# EAGLE design Resistor Module (EAGLE 6.4)

## Sheet 1 of 4: Resistor Bank
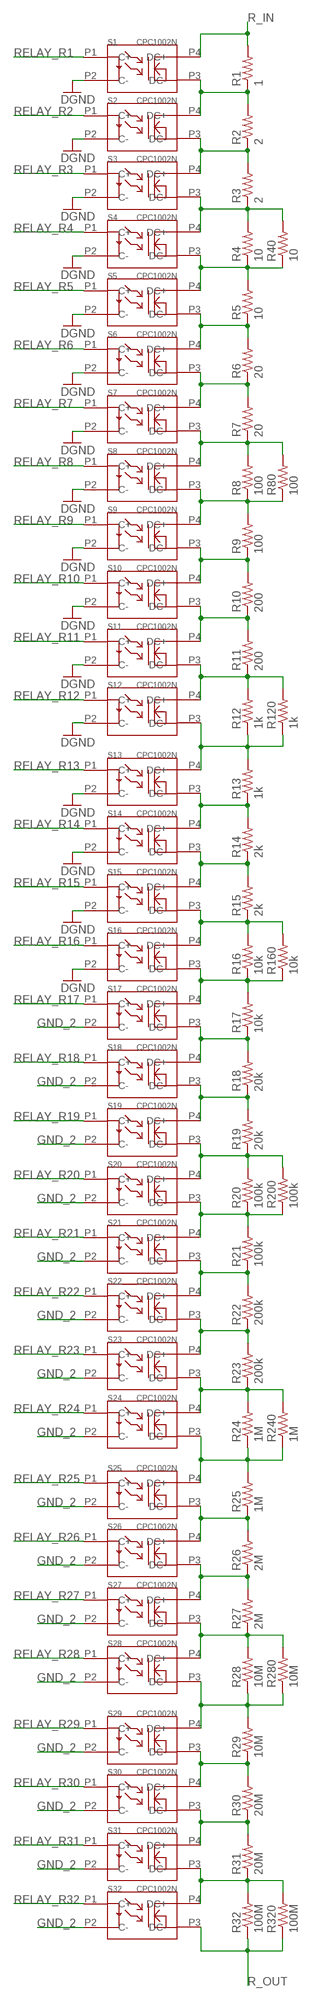
[diagram p0: schematic, sheet 1]

### Parts
R1  1  RESISTOR1206  [1206]
R2  2  RESISTOR1206  [1206]
R3  2  RESISTOR1206  [1206]
R4  10  RESISTOR1206  [1206]
R5  10  RESISTOR1206  [1206]
R6  20  RESISTOR1206  [1206]
R7  20  RESISTOR1206  [1206]
R8  100  RESISTOR1206  [1206]
R9  100  RESISTOR1206  [1206]
R10  200  RESISTOR1206  [1206]
R11  200  RESISTOR1206  [1206]
R12  1k  RESISTOR1206  [1206]
R13  1k  RESISTOR1206  [1206]
R14  2k  RESISTOR1206  [1206]
R15  2k  RESISTOR1206  [1206]
R16  10k  RESISTOR1206  [1206]
R17  10k  RESISTOR1206  [1206]
R18  20k  RESISTOR1206  [1206]
R19  20k  RESISTOR1206  [1206]
R20  100k  RESISTOR1206  [1206]
R21  100k  RESISTOR1206  [1206]
R22  200k  RESISTOR1206  [1206]
R23  200k  RESISTOR1206  [1206]
R24  1M  RESISTOR1206  [1206]
R25  1M  RESISTOR1206  [1206]
R26  2M  RESISTOR1206  [1206]
R27  2M  RESISTOR1206  [1206]
R28  10M  RESISTOR1206  [1206]
R29  10M  RESISTOR1206  [1206]
R30  20M  RESISTOR1206  [1206]
R31  20M  RESISTOR1206  [1206]
R32  100M  RESISTOR1206  [1206]
R40  10  RESISTOR1206  [1206]
R80  100  RESISTOR1206  [1206]
R120  1k  RESISTOR1206  [1206]
R160  10k  RESISTOR1206  [1206]
R200  100k  RESISTOR1206  [1206]
R240  1M  RESISTOR1206  [1206]
R280  10M  RESISTOR1206  [1206]
R320  100M  RESISTOR1206  [1206]
S1  CPC1002N  [CPC1002N]
S2  CPC1002N  [CPC1002N]
S3  CPC1002N  [CPC1002N]
S4  CPC1002N  [CPC1002N]
S5  CPC1002N  [CPC1002N]
S6  CPC1002N  [CPC1002N]
S7  CPC1002N  [CPC1002N]
S8  CPC1002N  [CPC1002N]
S9  CPC1002N  [CPC1002N]
S10  CPC1002N  [CPC1002N]
S11  CPC1002N  [CPC1002N]
S12  CPC1002N  [CPC1002N]
S13  CPC1002N  [CPC1002N]
S14  CPC1002N  [CPC1002N]
S15  CPC1002N  [CPC1002N]
S16  CPC1002N  [CPC1002N]
S17  CPC1002N  [CPC1002N]
S18  CPC1002N  [CPC1002N]
S19  CPC1002N  [CPC1002N]
S20  CPC1002N  [CPC1002N]
S21  CPC1002N  [CPC1002N]
S22  CPC1002N  [CPC1002N]
S23  CPC1002N  [CPC1002N]
S24  CPC1002N  [CPC1002N]
S25  CPC1002N  [CPC1002N]
S26  CPC1002N  [CPC1002N]
S27  CPC1002N  [CPC1002N]
S28  CPC1002N  [CPC1002N]
S29  CPC1002N  [CPC1002N]
S30  CPC1002N  [CPC1002N]
S31  CPC1002N  [CPC1002N]
S32  CPC1002N  [CPC1002N]

### Nets
GND: S1.P2(C-) S2.P2(C-) S3.P2(C-) S4.P2(C-) S5.P2(C-) S6.P2(C-) S7.P2(C-) S8.P2(C-) S9.P2(C-) S10.P2(C-) S11.P2(C-) S12.P2(C-) S13.P2(C-) S14.P2(C-) S15.P2(C-) S16.P2(C-) ; supply symbol labelled DGND ; also sheet 2,3
GND_2: S17.P2(C-) S18.P2(C-) S19.P2(C-) S20.P2(C-) S21.P2(C-) S22.P2(C-) S23.P2(C-) S24.P2(C-) S25.P2(C-) S26.P2(C-) S27.P2(C-) S28.P2(C-) S29.P2(C-) S30.P2(C-) S31.P2(C-) S32.P2(C-) ; also sheet 2,3
N$3: R2.1 R3.2 S2.P3(DC-) S3.P4(DC+)
N$4: R3.1 R4.2 R40.2 S3.P3(DC-) S4.P4(DC+)
N$5: R4.1 R5.2 R40.1 S4.P3(DC-) S5.P4(DC+)
N$6: R5.1 R6.2 S5.P3(DC-) S6.P4(DC+)
N$7: R6.1 R7.2 S6.P3(DC-) S7.P4(DC+)
N$8: R7.1 R8.2 R80.2 S7.P3(DC-) S8.P4(DC+)
N$10: R9.1 R10.2 S9.P3(DC-) S10.P4(DC+)
N$11: R10.1 R11.2 S10.P3(DC-) S11.P4(DC+)
N$15: R11.1 R12.2 R120.2 S11.P3(DC-) S12.P4(DC+)
N$25: R1.1 R2.2 S1.P3(DC-) S2.P4(DC+)
N$41: R14.1 R15.2 S14.P3(DC-) S15.P4(DC+)
N$42: R15.1 R16.2 R160.2 S15.P3(DC-) S16.P4(DC+)
N$44: R17.1 R18.2 S17.P3(DC-) S18.P4(DC+)
N$45: R18.1 R19.2 S18.P3(DC-) S19.P4(DC+)
N$46: R19.1 R20.2 R200.2 S19.P3(DC-) S20.P4(DC+)
N$47: R20.1 R21.2 R200.1 S20.P3(DC-) S21.P4(DC+)
N$48: R21.1 R22.2 S21.P3(DC-) S22.P4(DC+)
N$49: R22.1 R23.2 S22.P3(DC-) S23.P4(DC+)
N$50: R23.1 R24.2 R240.2 S23.P3(DC-) S24.P4(DC+)
N$51: R13.1 R14.2 S13.P3(DC-) S14.P4(DC+)
N$52: R24.1 R25.2 R240.1 S24.P3(DC-) S25.P4(DC+)
N$53: R28.1 R29.2 R280.1 S28.P3(DC-) S29.P4(DC+)
N$54: R25.1 R26.2 S25.P3(DC-) S26.P4(DC+)
N$55: R26.1 R27.2 S26.P3(DC-) S27.P4(DC+)
N$56: R27.1 R28.2 R280.2 S27.P3(DC-) S28.P4(DC+)
N$58: R29.1 R30.2 S29.P3(DC-) S30.P4(DC+)
N$59: R30.1 R31.2 S30.P3(DC-) S31.P4(DC+)
N$60: R31.1 R32.2 R320.2 S31.P3(DC-) S32.P4(DC+)
R80: R8.1 R9.2 R80.1 S8.P3(DC-) S9.P4(DC+)
R120: R12.1 R13.2 R120.1 S12.P3(DC-) S13.P4(DC+)
R160: R16.1 R17.2 R160.1 S16.P3(DC-) S17.P4(DC+)
R_IN: R1.2 S1.P4(DC+) ; also sheet 3
R_OUT: R32.1 R320.1 S32.P3(DC-) ; also sheet 3
RELAY_R1: S1.P1(C+) ; also sheet 2
RELAY_R2: S2.P1(C+) ; also sheet 2
RELAY_R3: S3.P1(C+) ; also sheet 2
RELAY_R4: S4.P1(C+) ; also sheet 2
RELAY_R5: S5.P1(C+) ; also sheet 2
RELAY_R6: S6.P1(C+) ; also sheet 2
RELAY_R7: S7.P1(C+) ; also sheet 2
RELAY_R8: S8.P1(C+) ; also sheet 2
RELAY_R9: S9.P1(C+) ; also sheet 2
RELAY_R10: S10.P1(C+) ; also sheet 2
RELAY_R11: S11.P1(C+) ; also sheet 2
RELAY_R12: S12.P1(C+) ; also sheet 2
RELAY_R13: S13.P1(C+) ; also sheet 2
RELAY_R14: S14.P1(C+) ; also sheet 2
RELAY_R15: S15.P1(C+) ; also sheet 2
RELAY_R16: S16.P1(C+) ; also sheet 2
RELAY_R17: S17.P1(C+) ; also sheet 2
RELAY_R18: S18.P1(C+) ; also sheet 2
RELAY_R19: S19.P1(C+) ; also sheet 2
RELAY_R20: S20.P1(C+) ; also sheet 2
RELAY_R21: S21.P1(C+) ; also sheet 2
RELAY_R22: S22.P1(C+) ; also sheet 2
RELAY_R23: S23.P1(C+) ; also sheet 2
RELAY_R24: S24.P1(C+) ; also sheet 2
RELAY_R25: S25.P1(C+) ; also sheet 2
RELAY_R26: S26.P1(C+) ; also sheet 2
RELAY_R27: S27.P1(C+) ; also sheet 2
RELAY_R28: S28.P1(C+) ; also sheet 2
RELAY_R29: S29.P1(C+) ; also sheet 2
RELAY_R30: S30.P1(C+) ; also sheet 2
RELAY_R31: S31.P1(C+) ; also sheet 2
RELAY_R32: S32.P1(C+) ; also sheet 2

## Sheet 2 of 4: Logic
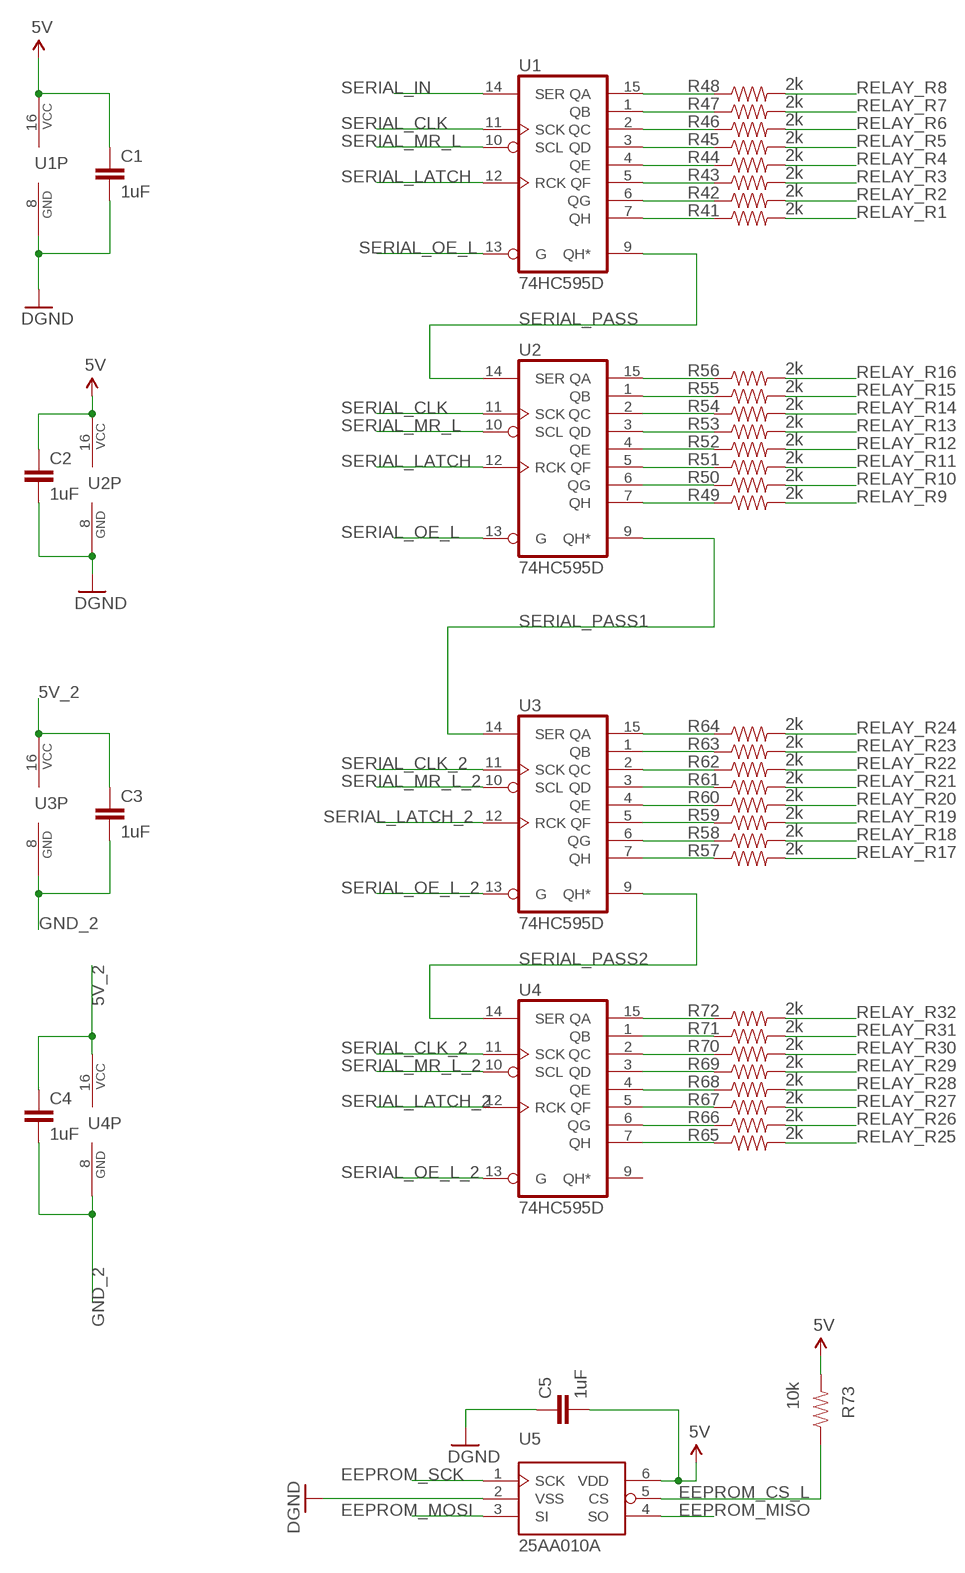
[diagram p1: schematic, sheet 2]

### Parts
C1  1uF  CAP0603-CAP  [0603-CAP]
C2  1uF  CAP0603-CAP  [0603-CAP]
C3  1uF  CAP0603-CAP  [0603-CAP]
C4  1uF  CAP0603-CAP  [0603-CAP]
C5  1uF  CAP0603-CAP  [0603-CAP]
R41  2k  RESISTOR0603-RES  [0603-RES]
R42  2k  RESISTOR0603-RES  [0603-RES]
R43  2k  RESISTOR0603-RES  [0603-RES]
R44  2k  RESISTOR0603-RES  [0603-RES]
R45  2k  RESISTOR0603-RES  [0603-RES]
R46  2k  RESISTOR0603-RES  [0603-RES]
R47  2k  RESISTOR0603-RES  [0603-RES]
R48  2k  RESISTOR0603-RES  [0603-RES]
R49  2k  RESISTOR0603-RES  [0603-RES]
R50  2k  RESISTOR0603-RES  [0603-RES]
R51  2k  RESISTOR0603-RES  [0603-RES]
R52  2k  RESISTOR0603-RES  [0603-RES]
R53  2k  RESISTOR0603-RES  [0603-RES]
R54  2k  RESISTOR0603-RES  [0603-RES]
R55  2k  RESISTOR0603-RES  [0603-RES]
R56  2k  RESISTOR0603-RES  [0603-RES]
R57  2k  RESISTOR0603-RES  [0603-RES]
R58  2k  RESISTOR0603-RES  [0603-RES]
R59  2k  RESISTOR0603-RES  [0603-RES]
R60  2k  RESISTOR0603-RES  [0603-RES]
R61  2k  RESISTOR0603-RES  [0603-RES]
R62  2k  RESISTOR0603-RES  [0603-RES]
R63  2k  RESISTOR0603-RES  [0603-RES]
R64  2k  RESISTOR0603-RES  [0603-RES]
R65  2k  RESISTOR0603-RES  [0603-RES]
R66  2k  RESISTOR0603-RES  [0603-RES]
R67  2k  RESISTOR0603-RES  [0603-RES]
R68  2k  RESISTOR0603-RES  [0603-RES]
R69  2k  RESISTOR0603-RES  [0603-RES]
R70  2k  RESISTOR0603-RES  [0603-RES]
R71  2k  RESISTOR0603-RES  [0603-RES]
R72  2k  RESISTOR0603-RES  [0603-RES]
R73  10k  RESISTOR0603-RES  [0603-RES]
U1  74HC595D  [SO16]
U2  74HC595D  [SO16]
U3  74HC595D  [SO16]
U4  74HC595D  [SO16]
U5  25AA010A  [SOT23-6]

### Nets
5V: C1.1 C2.1 C5.2 R73.2 U1.16(VCC) U2.16(VCC) U5.6(VDD) ; also sheet 3
5V_2: C3.1 C4.1 U3.16(VCC) U4.16(VCC) ; also sheet 3
EEPROM_CS_L: R73.1 U5.5(CS) ; also sheet 3
EEPROM_MISO: U5.4(SO) ; also sheet 3
EEPROM_MOSI: U5.3(SI) ; also sheet 3
EEPROM_SCK: U5.1(SCK) ; also sheet 3
GND: C1.2 C2.2 C5.1 U1.8(GND) U2.8(GND) U5.2(VSS) ; supply symbol labelled DGND ; also sheet 1,3
GND_2: C3.2 C4.2 U3.8(GND) U4.8(GND) ; also sheet 1,3
N$1: R48.1 U1.15(QA)
N$2: R47.1 U1.1(QB)
N$9: R46.1 U1.2(QC)
N$12: R45.1 U1.3(QD)
N$13: R44.1 U1.4(QE)
N$14: R43.1 U1.5(QF)
N$16: R42.1 U1.6(QG)
N$17: R41.1 U1.7(QH)
N$18: R56.1 U2.15(QA)
N$19: R55.1 U2.1(QB)
N$20: R54.1 U2.2(QC)
N$21: R53.1 U2.3(QD)
N$22: R52.1 U2.4(QE)
N$23: R51.1 U2.5(QF)
N$24: R50.1 U2.6(QG)
N$26: R49.1 U2.7(QH)
N$27: R64.1 U3.15(QA)
N$28: R63.1 U3.1(QB)
N$29: R62.1 U3.2(QC)
N$30: R61.1 U3.3(QD)
N$31: R60.1 U3.4(QE)
N$32: R59.1 U3.5(QF)
N$33: R58.1 U3.6(QG)
N$34: R57.1 U3.7(QH)
N$35: R72.1 U4.15(QA)
N$36: R71.1 U4.1(QB)
N$37: R70.1 U4.2(QC)
N$38: R69.1 U4.3(QD)
N$39: R68.1 U4.4(QE)
N$40: R67.1 U4.5(QF)
N$43: R66.1 U4.6(QG)
N$57: R65.1 U4.7(QH)
RELAY_R1: R41.2 ; also sheet 1
RELAY_R2: R42.2 ; also sheet 1
RELAY_R3: R43.2 ; also sheet 1
RELAY_R4: R44.2 ; also sheet 1
RELAY_R5: R45.2 ; also sheet 1
RELAY_R6: R46.2 ; also sheet 1
RELAY_R7: R47.2 ; also sheet 1
RELAY_R8: R48.2 ; also sheet 1
RELAY_R9: R49.2 ; also sheet 1
RELAY_R10: R50.2 ; also sheet 1
RELAY_R11: R51.2 ; also sheet 1
RELAY_R12: R52.2 ; also sheet 1
RELAY_R13: R53.2 ; also sheet 1
RELAY_R14: R54.2 ; also sheet 1
RELAY_R15: R55.2 ; also sheet 1
RELAY_R16: R56.2 ; also sheet 1
RELAY_R17: R57.2 ; also sheet 1
RELAY_R18: R58.2 ; also sheet 1
RELAY_R19: R59.2 ; also sheet 1
RELAY_R20: R60.2 ; also sheet 1
RELAY_R21: R61.2 ; also sheet 1
RELAY_R22: R62.2 ; also sheet 1
RELAY_R23: R63.2 ; also sheet 1
RELAY_R24: R64.2 ; also sheet 1
RELAY_R25: R65.2 ; also sheet 1
RELAY_R26: R66.2 ; also sheet 1
RELAY_R27: R67.2 ; also sheet 1
RELAY_R28: R68.2 ; also sheet 1
RELAY_R29: R69.2 ; also sheet 1
RELAY_R30: R70.2 ; also sheet 1
RELAY_R31: R71.2 ; also sheet 1
RELAY_R32: R72.2 ; also sheet 1
SERIAL_CLK: U1.11(SCK) U2.11(SCK) ; also sheet 3
SERIAL_CLK_2: U3.11(SCK) U4.11(SCK) ; also sheet 3
SERIAL_IN: U1.14(SER) ; also sheet 3
SERIAL_LATCH: U1.12(RCK) U2.12(RCK) ; also sheet 3
SERIAL_LATCH_2: U3.12(RCK) U4.12(RCK) ; also sheet 3
SERIAL_MR_L: U1.10(SCL) U2.10(SCL) ; also sheet 3
SERIAL_MR_L_2: U3.10(SCL) U4.10(SCL) ; also sheet 3
SERIAL_OE_L: U1.13(G) U2.13(G) ; also sheet 3
SERIAL_OE_L_2: U3.13(G) U4.13(G) ; also sheet 3
SERIAL_PASS: U1.9(QH*) U2.14(SER)
SERIAL_PASS1: U2.9(QH*) U3.14(SER)
SERIAL_PASS2: U3.9(QH*) U4.14(SER)
Unconnected: U4.9(QH*)

## Sheet 3 of 4: Interface
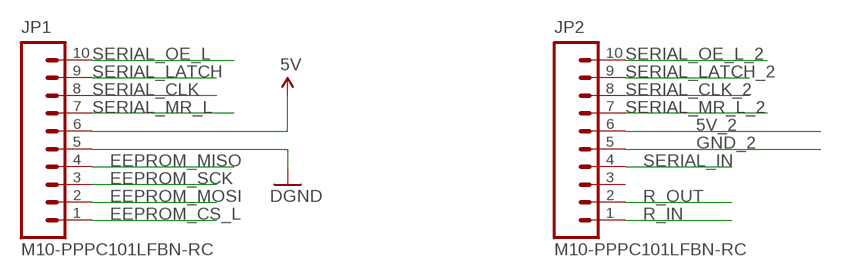
[diagram p2: schematic, sheet 3]

### Parts
JP1  M10-PPPC101LFBN-RC  [PPPC101LFBN-RC]
JP2  M10-PPPC101LFBN-RC  [PPPC101LFBN-RC]

### Nets
5V: JP1.6 ; also sheet 2
5V_2: JP2.6 ; also sheet 2
EEPROM_CS_L: JP1.1 ; also sheet 2
EEPROM_MISO: JP1.4 ; also sheet 2
EEPROM_MOSI: JP1.2 ; also sheet 2
EEPROM_SCK: JP1.3 ; also sheet 2
GND: JP1.5 ; supply symbol labelled DGND ; also sheet 1,2
GND_2: JP2.5 ; also sheet 1,2
R_IN: JP2.1 ; also sheet 1
R_OUT: JP2.2 ; also sheet 1
SERIAL_CLK: JP1.8 ; also sheet 2
SERIAL_CLK_2: JP2.8 ; also sheet 2
SERIAL_IN: JP2.4 ; also sheet 2
SERIAL_LATCH: JP1.9 ; also sheet 2
SERIAL_LATCH_2: JP2.9 ; also sheet 2
SERIAL_MR_L: JP1.7 ; also sheet 2
SERIAL_MR_L_2: JP2.7 ; also sheet 2
SERIAL_OE_L: JP1.10 ; also sheet 2
SERIAL_OE_L_2: JP2.10 ; also sheet 2
Unconnected: JP2.3

## Sheet 4 of 4: Mechanical
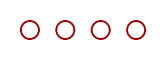
[diagram p3: schematic, sheet 4]

### Parts
STANDOFF1  STAND-OFF  [STAND-OFF]
STANDOFF2  STAND-OFF  [STAND-OFF]
STANDOFF3  STAND-OFF  [STAND-OFF]
STANDOFF4  STAND-OFF  [STAND-OFF]

## Library data of the parts
C1-C5 = Resistor Module Library:CAP: Capacitor Standard 0603 ceramic capacitor, and 0.1" leaded capacitor.
JP1 JP2 = Resistor Module Library:M10: Header 10 Standard 10-pin 0.1" header. Use with straight break away headers (SKU : PRT-00116), right angle break away headers (PRT-00553), swiss pins (PRT-00743), machine pins (PRT-00117), and female headers (PRT-00115).
R1-R32 R40-R73 R80 R120 R160 R200 R240 R280 R320 = Resistor Module Library:RESISTOR: Resistor Basic schematic elements and footprints for 0603, 1206, and PTH resistors.
S1-S32 = Resistor Module Library:CPC1002N
STANDOFF1-STANDOFF4 = Resistor Module Library:STAND-OFF: #4 Stand Off This is the mechanical footprint for a #4 phillips button head screw. Use the keepout ring to avoid running the screw head into surrounding components. SKU : PRT-00447
U1-U4 = Resistor Module Library:74*595: 8-bit SHIFT REGISTER, output latch
U5 = Resistor Module Library:25AA010A

## Board
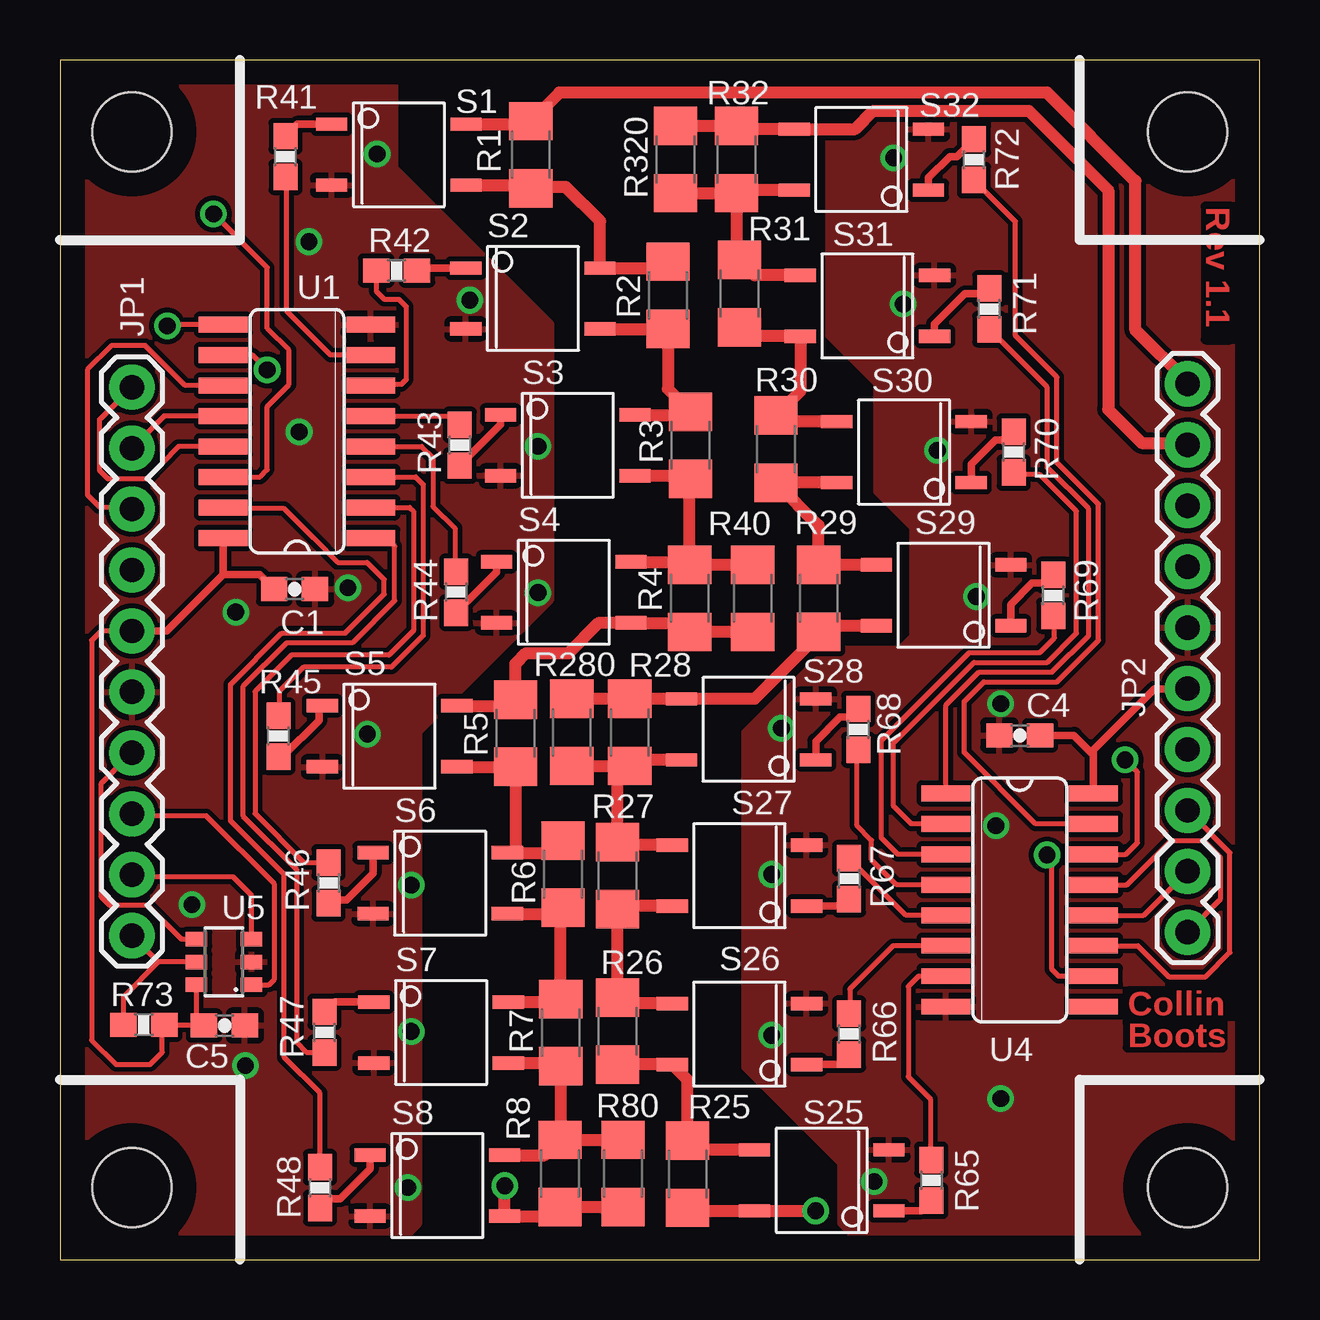
[diagram p4: board, top side]
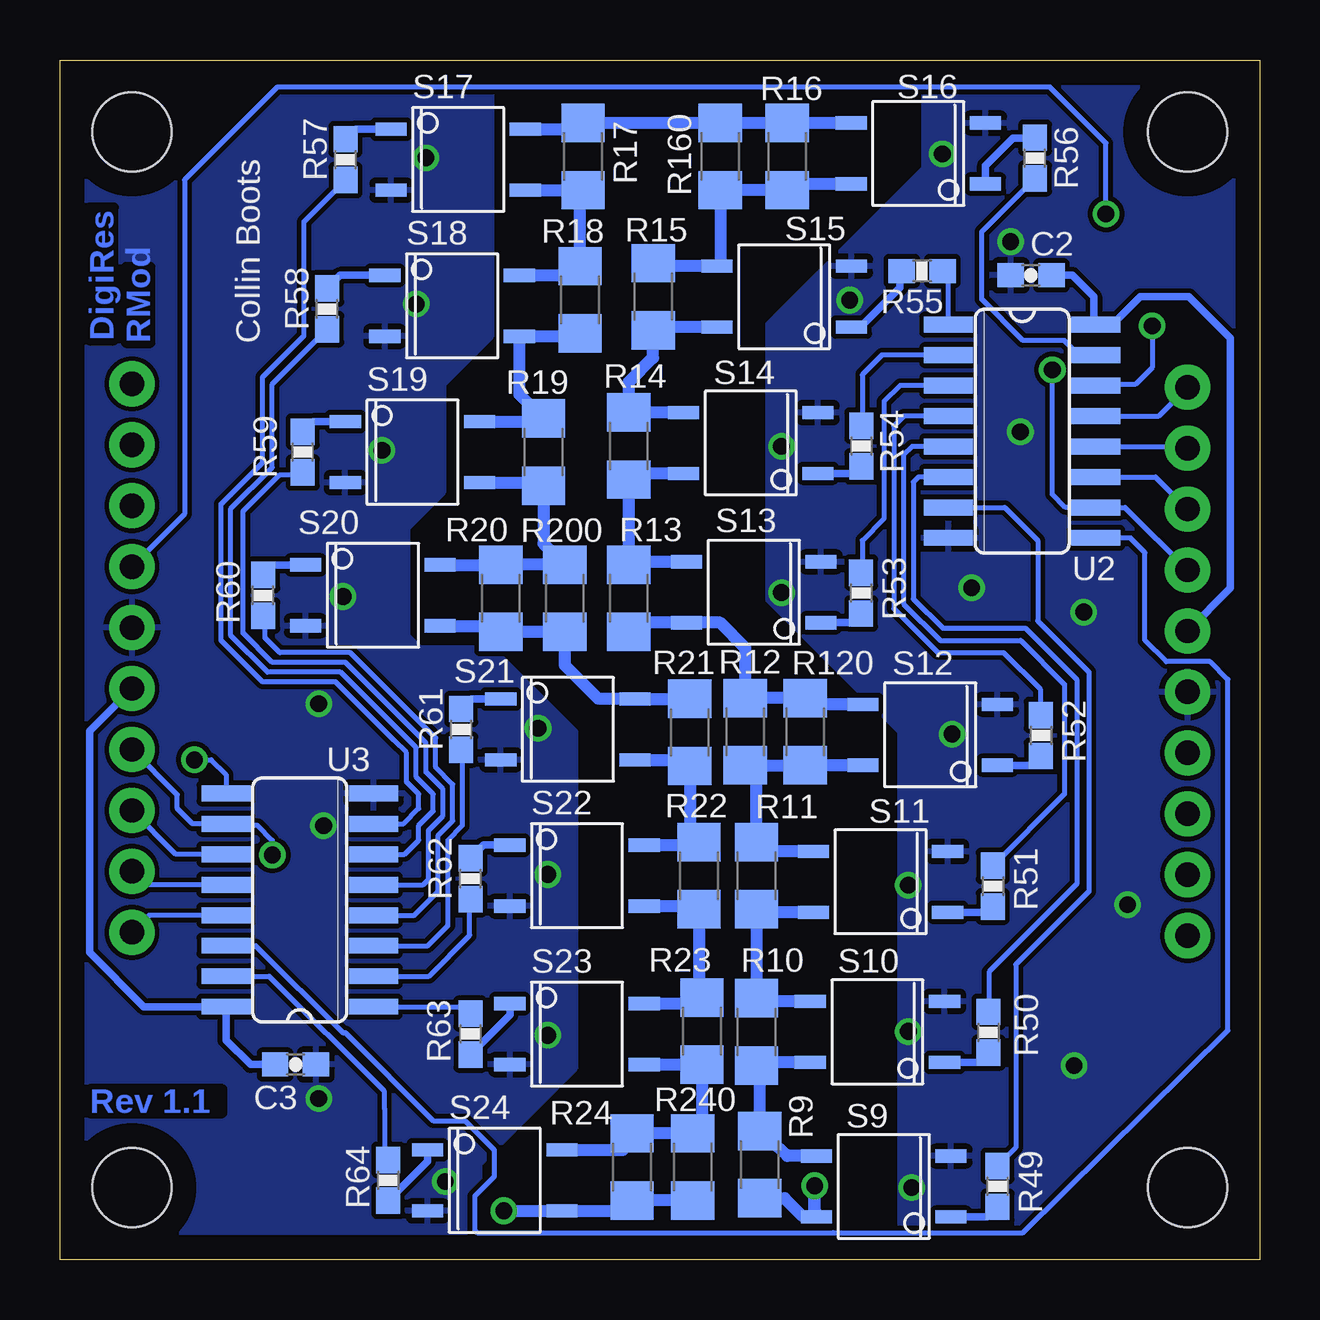
[diagram p5: board, bottom side, seen from below]

Size 50 x 50 mm. Coordinates in mm from the lower left corner, seen from the top.
Outline: 0,0 50,0 50,50 0,50 0,0
Copper layers (1*16): Top 0.035mm / dielectric 1.5mm / Bottom 0.035mm
Design rules "default *": minimum track width 8mil, minimum drill 24mil, track to track 8mil, track to pad 8mil, pad to pad 8mil, via to via 8mil, smd to smd 8mil, copper to edge 40mil, drill to drill 8mil, minimum pad ring 10mil, minimum via ring 8mil, stop-mask expansion 4mil, vias tented up to drill 30mil, thermal gap 10mil

### Footprints (pad centres in the part's own frame; a part is rotated, then mirrored left to right if it is on the bottom)
0603-CAP = smd 1.1 x 1: 1 -0.85,0; 2 0.85,0
PPPC101LFBN-RC = drill 1.016 pad 1.88: 1 0,0; 2 2.54,0; 3 5.08,0; 4 7.62,0; 5 10.16,0; 6 12.7,0; 7 15.24,0; 8 17.78,0; 9 20.32,0; 10 22.86,0
1206 = smd 1.6 x 1.8: 1 -1.4,0; 2 1.4,0
0603-RES = smd 1.1 x 1: 1 -0.85,0; 2 0.85,0
CPC1002N = smd 0.551 x 1.3: P1 -1.27,-2.8; P2 1.27,-2.8; P3 1.27,2.8; P4 -1.27,2.8
STAND-OFF = hole 3.302: 0,0
SO16 = smd 0.66 x 2.032: 1 -4.445,-3.073; 2 -3.175,-3.073; 3 -1.905,-3.073; 4 -0.635,-3.073; 5 0.635,-3.073; 6 1.905,-3.073; 7 3.175,-3.073; 8 4.445,-3.073; 9 4.445,3.073; 10 3.175,3.073; 11 1.905,3.073; 12 0.635,3.073; 13 -0.635,3.073; 14 -1.905,3.073; 15 -3.175,3.073; 16 -4.445,3.073
SOT23-6 = smd 0.6 x 0.9: 1 -0.95,-1.15; 2 0,-1.15; 3 0.95,-1.15; 4 0.95,1.15; 5 0,1.15; 6 -0.95,1.15

### Placement (x,y rotation side)
C1  9.78,27.94 0 top
C2  9.53,41.02 180 bottom
C3  40.18,8.13 0 bottom
C4  40.01,21.84 180 top
C5  6.86,9.75 180 top
JP1  3,13.5 90 top
JP2  47,36.5 270 top
R1  19.63,46.05 90 top
R2  25.34,40.19 90 top
R3  26.29,33.94 90 top
R4  26.25,27.56 90 top
R5  18.98,21.94 90 top
R6  20.97,16.07 90 top
R7  20.87,9.46 90 top
R8  20.85,3.59 90 top
R9  20.83,3.96 270 bottom
R10  20.97,9.49 270 bottom
R11  20.97,16 270 bottom
R12  21.43,22 270 bottom
R13  26.29,27.56 270 bottom
R14  26.29,33.91 270 bottom
R15  25.27,40.13 270 bottom
R16  19.68,45.97 270 bottom
R17  28.19,45.97 90 bottom
R18  28.32,40.01 90 bottom
R19  29.84,33.66 90 bottom
R20  31.62,27.56 90 bottom
R21  23.75,21.97 90 bottom
R22  23.37,16 90 bottom
R23  23.24,9.53 90 bottom
R24  26.16,3.86 90 bottom
R25  26.16,3.56 270 top
R26  23.24,9.53 270 top
R27  23.24,16 270 top
R28  23.75,21.97 270 top
R29  31.62,27.56 270 top
R30  29.84,33.78 270 top
R31  28.32,40.26 270 top
R32  28.19,45.85 270 top
R40  28.87,27.56 90 top
R41  9.4,45.97 90 top
R42  14.03,41.22 0 top
R43  16.66,33.94 270 top
R44  16.51,27.82 270 top
R45  9.11,21.82 270 top
R46  11.19,15.7 270 top
R47  11.03,9.47 90 top
R48  10.84,3 270 top
R49  10.92,3.05 270 bottom
R50  11.3,9.47 270 bottom
R51  11.12,15.56 270 bottom
R52  9.12,21.84 270 bottom
R53  16.61,27.78 270 bottom
R54  16.6,33.91 270 bottom
R55  14.06,41.21 180 bottom
R56  9.36,45.91 90 bottom
R57  38.1,45.85 90 bottom
R58  38.86,39.62 90 bottom
R59  39.88,33.66 90 bottom
R60  41.53,27.69 90 bottom
R61  33.27,22.1 90 bottom
R62  32.89,15.88 90 bottom
R63  32.89,9.4 270 bottom
R64  36.32,3.3 270 bottom
R65  36.32,3.3 270 top
R66  32.89,9.4 270 top
R67  32.89,15.88 270 top
R68  33.27,22.1 90 top
R69  41.4,27.69 90 top
R70  39.75,33.66 90 top
R71  38.73,39.62 90 top
R72  38.1,45.85 90 top
R73  3.5,9.79 0 top
R80  23.47,3.59 90 top
R120  18.93,22 270 bottom
R160  22.48,45.97 270 bottom
R200  28.96,27.56 90 bottom
R240  23.62,3.86 90 bottom
R280  21.34,21.97 270 top
R320  25.65,45.85 270 top
S1  14.13,46.05 270 top
S2  19.71,40.06 270 top
S3  21.17,33.94 270 top
S4  21,27.81 270 top
S5  13.74,21.81 270 top
S6  15.85,15.68 270 top
S7  15.89,9.46 270 top
S8  15.73,3.08 270 top
S9  15.66,3.05 90 bottom
S10  15.93,9.49 90 bottom
S11  15.8,15.74 90 bottom
S12  13.73,21.87 90 bottom
S13  21.08,27.81 90 bottom
S14  21.21,34.04 90 bottom
S15  19.81,40.13 90 bottom
S16  14.22,46.1 90 bottom
S17  33.4,45.85 270 bottom
S18  33.66,39.75 270 bottom
S19  35.31,33.66 270 bottom
S20  36.96,27.69 270 bottom
S21  28.83,22.1 270 bottom
S22  28.45,16 270 bottom
S23  28.45,9.4 270 bottom
S24  31.88,3.3 270 bottom
S25  31.75,3.3 90 top
S26  28.32,9.4 90 top
S27  28.32,16 90 top
S28  28.7,22.1 90 top
S29  36.83,27.69 90 top
S30  35.18,33.66 90 top
S31  33.66,39.75 90 top
S32  33.4,45.85 90 top
STANDOFF1  3,3 0 top
STANDOFF2  3,47 0 top
STANDOFF3  47,47 0 top
STANDOFF4  47,3 0 top
U1  9.88,34.52 90 top
U2  9.89,34.53 270 bottom
U3  40.01,14.99 90 bottom
U4  40.01,14.99 270 top
U5  6.84,12.4 90 top

### Tracks (layer width: path | path; a pad name or v marks a point on that pad's centre or on a via)
5V
  Top 0.203: U5.6 5.69,10.07 C5.2 5.97,9.79 R73.2 4.27,9.71 4.27,8.64 3.76,8.13 2.34,8.13 1.32,9.14 1.32,25.81 1.71,26.2 4.46,26.2
  Top 0.305: JP1.6 4.46,26.2 6.81,28.55 | 6.81,28.55 U1.16 | 6.81,28.55 8.32,28.55 C1.1
  Bottom 0.305: C2.1 7.8,41.02 6.91,40.13 6.91,39.06 U2.16 6.14,38.97 4.98,40.13 2.95,40.13 1.22,38.41 1.22,27.98 JP1.6
5V_2
  Top 0.305: U4.16 43.08,21.03 | 43.08,21.03 43.08,21.23 45.62,23.77 46.97,23.77 JP2.6 | C4.1 42.27,21.84 43.08,21.03
  Bottom 0.305: C3.1 42.06,8.13 43.08,9.14 U3.16 46.51,10.54 48.77,12.8 48.77,22.03 JP2.6
EEPROM_CS_L
  Top 0.203: U5.5 4.1,12.4 | 4.1,12.4 JP1.1 | R73.1 2.65,10.95 4.1,12.4
EEPROM_MISO
  Top 0.203: U5.4 5.06,13.35 3.66,14.76 2.08,14.76 1.73,15.11 1.73,19.85 JP1.4
EEPROM_MOSI
  Top 0.203: U5.3 7.99,15.18 7.21,15.95 3.09,15.95 JP1.2
EEPROM_SCK
  Top 0.203: U5.1 8.71,11.45 8.94,11.68 8.94,15.65 6.1,18.49 3.09,18.49 JP1.3
GND  (via drill 0.7)
  other vias: 14.5,3 12,28 19.92,27.8 19.92,33.89 12.81,21.9 14.64,15.6 14.64,9.51 7.73,8.09 5.5,14.79 7.33,26.98 9.97,34.5 13.22,46.08 17.08,39.99 10.37,42.43
  pour Top: 0,0 13.5,0 15,1.5 15,22 20.5,27.5 20.5,39 14,45.5 14,49 13,50 0,50
  pour Bottom: 0,0 13.5,0 15,1.5 15,22 20.5,27.5 20.5,39 14,45.5 14,49 13,50 0,50
GND_2  (via drill 0.7)
  other vias: 33.93,3.25 39.22,6.71 39.22,23.16 39.01,18.08 38.2,27.64 30.07,22.15 29.67,16.05 29.67,9.35 36.58,33.73 35.15,39.83 34.75,45.92
  pour Top: 50,50 50,0 34,0 32.5,1.5 32.5,4 28.5,8 28.5,22 32,25.5 35,25.5 35.5,26 35.5,30.5 34,32 34,36.5 32,38.5 32,50
  pour Bottom: 50,50 50,0 34,0 32.5,1.5 32.5,4 28.5,8 28.5,22 32,25.5 35,25.5 35.5,26 35.5,30.5 34,32 34,36.5 32,38.5 32,50
N$1
  Top 0.203: R48.1 10.84,6.94 9.35,8.43 9.35,16.05 7.11,18.29 7.11,23.98 9.25,26.11 11.89,26.11 13.51,27.74 13.51,28.35 12.8,29.06 11.58,29.06 10.57,30.07 9.35,31.29 6.86,31.29 U1.15
N$2
  Top 0.203: R47.1 11.02,8.64 10.26,8.64 9.86,9.04 9.86,16.26 7.62,18.49 7.62,23.88 9.45,25.7 12.19,25.7 13.95,27.47 13.95,29.73 13.61,30.07 U1.1
N$3
  Top 0.508: S2.P3 R2.1 25.34,36.28 R3.2 26.16,35.21 S3.P4
N$4
  Top 0.508: S3.P3 26.16,32.67 R3.1 26.25,32.5 R4.2 | R40.2 R4.2 | S4.P4 26.12,29.08 R4.2
N$5
  Top 0.508: R40.1 R4.1 25.86,26.54 S4.P3 22.48,26.54 21.21,25.27 19.43,25.27 18.98,24.83 R5.2 18.73,23.08 S5.P4
N$6
  Top 0.508: S6.P4 19.18,16.95 | 19.18,16.95 20.46,16.95 R6.2 | 19.18,16.95 18.98,17.15 R5.1 S5.P3
N$7
  Top 0.508: S6.P3 20.72,14.41 R6.1 20.87,14.57 R7.2 20.74,10.73 S7.P4
N$8
  Top 0.508: S7.P3 20.74,8.19 R7.1 20.87,5.01 R8.2 | S8.P4 20.21,4.35 R8.2 | R8.2 R80.2
N$9
  Top 0.203: U1.2 14.57,31.35 14.73,31.19 14.73,26.21 13.72,25.2 9.65,25.2 8.13,23.67 8.13,18.59 10.16,16.56 R46.1
N$10
  Bottom 0.508: S10.P4 20.84,8.22 R10.2 20.83,7.96 R9.1 19.69,4.32 S9.P3
N$11
  Bottom 0.508: S11.P4 20.84,14.47 R11.2 R10.1 20.84,10.76 S10.P3
N$12
  Top 0.203: U1.3 14.83,32.62 15.14,32.31 15.14,26.01 13.82,24.69 10.16,24.69 9.14,23.67 9.14,22.7 R45.1
N$13
  Top 0.203: U1.4 15.08,33.89 15.54,33.43 15.54,31.39 16.46,30.48 16.46,28.72 R44.1
N$14
  Top 0.203: U1.5 16.3,35.16 R43.1
N$15
  Bottom 0.508: S11.P3 20.58,17.01 R11.1 20.97,20.13 R12.2 R120.2 S12.P4
N$16
  Top 0.203: R42.1 13.18,40.36 13.51,40.03 14.12,40.03 14.43,39.73 14.43,36.68 14.22,36.47 13,36.47 U1.6
N$17
  Top 0.203: U1.7 11.27,37.7 9.45,39.52 9.45,45.07 R41.1
N$18
  Bottom 0.203: U2.15 7.53,37.7 8.13,38.3 9.86,38.3 11.58,40.03 11.58,42.84 R56.1
N$19
  Bottom 0.203: U2.1 12.97,40.96 R55.1
N$20
  Bottom 0.203: U2.2 15.74,37.7 16.56,36.88 16.56,34.8 R54.1
N$21
  Bottom 0.203: U2.3 14.98,36.43 15.65,35.76 15.65,30.89 16.56,29.97 16.56,28.68 R53.1
N$22
  Bottom 0.203: U2.4 14.83,35.16 15.24,34.75 15.24,27.13 13.41,25.3 10.67,25.3 9.14,23.77 9.14,22.72 R52.1
N$23
  Bottom 0.203: U2.5 14.47,33.89 14.83,33.53 14.83,27.33 13.31,25.81 9.96,25.81 8.13,23.98 8.13,19.4 R51.1
N$24
  Bottom 0.203: U2.6 14.22,32.62 14.43,32.41 14.43,27.53 13.21,26.31 9.75,26.31 7.62,24.18 7.62,15.65 11.28,11.99 11.28,10.35 R50.1
N$25
  Top 0.508: S1.P3 19.63,44.78 R1.1 19.68,44.7 21.08,44.7 22.51,43.27 S2.P4 25.08,41.33 R2.2
N$26
  Bottom 0.203: U2.7 10.62,31.35 9.25,29.97 9.25,26.62 7.11,24.49 7.11,15.34 10.16,12.29 10.16,4.66 R49.1
N$27
  Bottom 0.203: U3.15 41.27,11.81 36.47,7.01 36.47,6.3 36.47,4.3 R64.1
N$28
  Bottom 0.203: U3.1 33.19,10.54 R63.1
N$29
  Bottom 0.203: U3.2 34.62,11.81 32.92,13.51 32.92,15 R62.1
N$30
  Bottom 0.203: U3.3 34.67,13.08 33.83,13.92 33.83,17.48 33.22,18.09 33.22,21.2 R61.1
N$31
  Bottom 0.203: U3.4 35.23,14.35 34.24,15.34 34.24,17.68 33.63,18.29 33.63,19.81 34.34,20.52 34.34,21.74 37.9,25.3 40.84,25.3 41.45,25.91 41.45,26.76 R60.1
N$32
  Bottom 0.203: U3.5 34.87,15.62 34.65,15.85 34.65,17.88 34.04,18.49 34.04,19.61 34.75,20.32 34.75,21.54 38,24.79 38.1,24.89 41.15,24.89 42.37,26.11 42.37,31.19 40.84,32.72 39.97,32.72 R59.1
N$33
  Bottom 0.203: U3.6 35.64,16.89 35.05,17.48 35.05,18.09 34.44,18.69 34.44,19.41 35.15,20.12 35.15,21.34 38.3,24.49 41.35,24.49 42.88,26.01 42.88,31.29 41.15,33.02 41.15,36.49 R58.1
N$34
  Bottom 0.203: U3.7 35.69,18.16 35.05,18.8 35.05,19.41 35.56,19.91 35.56,21.13 36.07,21.64 38.51,24.08 41.55,24.08 43.28,25.81 43.28,31.5 41.55,33.22 41.55,36.78 39.83,38.51 39.83,43.27 R57.1
N$35
  Top 0.203: U4.15 40.66,18.16 37.69,21.13 37.69,23.27 38.51,24.08 41.55,24.08 43.28,25.81 43.28,31.5 41.55,33.22 41.55,36.78 39.83,38.51 39.83,43.27 R72.1
N$36
  Top 0.203: U4.1 36.93,23.11 38.3,24.49 41.35,24.49 42.88,26.01 42.88,31.29 41.15,33.02 41.15,36.36 R71.1
N$37
  Top 0.203: U4.2 35.48,18.16 34.75,18.9 34.75,21.54 38.1,24.89 41.15,24.89 42.37,26.11 42.37,31.19 40.84,32.72 39.84,32.72 R70.1
N$38
  Top 0.203: U4.3 34.92,16.89 34.24,17.58 34.24,21.64 37.9,25.3 40.84,25.3 41.45,25.91 41.45,26.79 R69.1
N$39
  Top 0.203: U4.4 34.87,15.62 33.83,16.66 33.83,17.48 33.22,18.09 33.22,21.2 R68.1
N$40
  Top 0.203: U4.5 35.27,14.35 R67.1
N$41
  Bottom 0.508: S15.P4 25.14,38.86 R15.2 25.27,37.59 26.29,36.58 R14.1 S14.P3
N$42
  Bottom 0.508: R15.1 25.14,41.4 S15.P3 22.48,41.53 R160.2 R16.2 19.43,44.83 S16.P4
N$43
  Top 0.203: U4.6 34.72,13.08 32.92,11.28 32.92,10.27 R66.1
N$44
  Bottom 0.508: S17.P3 R17.1 28.32,44.45 R18.2 28.7,41.02 S18.P4
N$45
  Bottom 0.508: R18.1 28.45,38.48 S18.P3 30.86,36.06 R19.2 29.98,34.92 S19.P4
N$46
  Bottom 0.508: S19.P3 29.98,32.38 R19.1 29.84,29.85 R200.2 R20.2 S20.P4
N$47
  Bottom 0.508: S20.P3 31.88,26.42 R20.1 R200.1 28.96,24.77 27.56,23.37 S21.P4 R21.2
N$48
  Bottom 0.508: S21.P3 24.01,20.83 R21.1 23.75,17.78 R22.2 23.5,17.27 S22.P4
N$49
  Bottom 0.508: S22.P3 23.5,14.73 R22.1 23.37,11.05 R23.2 23.5,10.67 S23.P4
N$50
  Bottom 0.508: S23.P3 R23.1 23.24,5.34 R240.2 R24.2 26.55,4.57 S24.P4
N$51
  Bottom 0.508: S14.P4 26.03,32.77 R14.2 R13.1 26.16,29.08 S13.P3
N$52  (via drill 0.7)
  Top 0.508: S25.P4 | S25.P4 v31.5,2.03 | R25.2 26.55,2.16 26.67,2.03 S25.P4
  Bottom 0.508: R240.1 R24.1 26.29,2.03 S24.P3 v31.5,2.03
N$53
  Top 0.508: S29.P4 31.88,26.42 R29.2 31.62,26.04 28.96,23.37 S28.P3 R28.1 R280.1
N$54
  Top 0.508: R26.2 S26.P4 26.16,7.49 R25.1 26.55,4.57 S25.P3
N$55
  Top 0.508: S27.P4 23.37,14.73 R27.2 R26.1 23.5,10.67 S26.P3
N$56
  Top 0.508: R280.2 R28.2 | S28.P4 24.01,20.83 R28.2 | S27.P3 23.37,17.27 R27.1 23.24,20.06 R28.2
N$57
  Top 0.203: U4.7 35.79,11.81 35.36,11.38 35.36,7.62 36.27,6.71 36.27,4.2 R65.1
N$58
  Top 0.508: S30.P4 R30.2 31.62,30.6 R29.1 S29.P3
N$59
  Top 0.508: R31.2 28.7,38.48 S31.P4 30.86,36.19 R30.1 30.1,34.92 S30.P3
N$60
  Top 0.508: R320.2 R32.2 | S32.P4 28.2,44.58 R32.2 | R32.2 28.19,41.79 R31.1 28.96,41.02 S31.P3
R80  (via drill 0.7)
  Top 0.203: 20.83,2.15 20.83,2.17 R8.1
  Top 0.508: 20.83,2.15 20.49,1.81 S8.P3 18.5,1.78 18.52,1.78 v18.54,3.07 | R8.1 R80.1
  Bottom 0.508: S9.P4 18.52,1.78 v18.54,3.07 18.55,1.84 S8.P3 19.05,1.81 19.8,2.56 R9.2
R120
  Bottom 0.508: R13.2 25.91,26.54 S13.P4 22.48,26.54 21.43,25.5 R12.1 R120.1 18.68,23.14 S12.P3
R160
  Bottom 0.508: S16.P3 R16.1 R160.1 R17.2 28.45,47.12 S17.P4
R_IN
  Top 0.508: S1.P4 19.5,47.32 R1.2 20.82,48.64 41.15,48.64 44.83,44.96 44.83,38.73 47,36.57 JP2.1
R_OUT
  Top 0.508: R320.1 R32.1 28.45,47.12 S32.P3 33.15,47.12 33.91,47.88 40.39,47.88 43.69,44.58 43.69,35.43 45.09,34.04 46.92,34.04 JP2.2
RELAY_R1
  Top 0.305: S1.P1 9.89,47.32 R41.2
RELAY_R2
  Top 0.305: S2.P1 14.99,41.33 R42.2
RELAY_R3
  Top 0.305: S3.P1 18.37,34.8 R43.2
RELAY_R4
  Top 0.305: S4.P1 18.2,28.66 R44.2
RELAY_R5
  Top 0.305: R45.2 9.28,20.96 10.79,22.48 10.79,22.94 S5.P1
RELAY_R6
  Top 0.305: S6.P1 13.05,16.1 11.94,14.99 11.33,14.99 R46.2
RELAY_R7
  Top 0.305: S7.P1 11.44,10.73 R47.2
RELAY_R8
  Top 0.305: S8.P1 12.93,3.78 11.68,2.54 11.23,2.54 R48.2
RELAY_R9
  Bottom 0.305: S9.P1 11.34,1.78 R49.2
RELAY_R10
  Bottom 0.305: S10.P1 11.71,8.22 R50.2
RELAY_R11
  Bottom 0.305: S11.P1 11.36,14.47 R51.2
RELAY_R12
  Bottom 0.305: S12.P1 9.5,20.6 R52.2
RELAY_R13
  Bottom 0.305: S13.P1 16.99,26.54 R53.2
RELAY_R14
  Bottom 0.305: S14.P1 16.89,32.77 R54.2
RELAY_R15
  Bottom 0.305: S15.P1 16.64,38.86 14.99,40.51 14.99,41.14 R55.2
RELAY_R16
  Bottom 0.305: S16.P1 11.42,45.6 10.29,46.74 9.39,46.74 R56.2
RELAY_R17
  Bottom 0.305: S17.P1 37.68,47.12 R57.2
RELAY_R18
  Bottom 0.305: S18.P1 38.31,41.02 R58.2
RELAY_R19
  Bottom 0.305: S19.P1 39.46,34.92 R59.2
RELAY_R20
  Bottom 0.305: S20.P1 41.11,28.96 R60.2
RELAY_R21
  Bottom 0.305: S21.P1 32.85,23.37 R61.2
RELAY_R22
  Bottom 0.305: S22.P1 32.35,17.27 R62.2
RELAY_R23
  Bottom 0.305: S23.P1 31.25,10.19 R63.2
RELAY_R24
  Bottom 0.305: S24.P1 34.68,4.1 R64.2
RELAY_R25
  Top 0.305: S25.P1 35.9,2.03 R65.2
RELAY_R26
  Top 0.305: S26.P1 32.47,8.13 R66.2
RELAY_R27
  Top 0.305: S27.P1 32.6,14.73 R67.2
RELAY_R28
  Top 0.305: S28.P1 31.5,21.6 32.51,22.61 32.93,22.61 R68.2
RELAY_R29
  Top 0.305: S29.P1 39.63,27.31 40.51,28.19 41.06,28.19 R69.2
RELAY_R30
  Top 0.305: S30.P1 37.98,33.15 38.99,34.16 39.41,34.16 R70.2
RELAY_R31
  Top 0.305: S31.P1 36.45,38.99 37.72,40.26 38.52,40.26 R71.2
RELAY_R32
  Top 0.305: S32.P1 36.2,45.09 37.08,45.97 37.38,45.97 R72.2
SERIAL_CLK
  Top 0.203: U1.11 5.23,36.43 3.56,38.1 2.16,38.1 1.14,37.08 1.14,31.88 1.65,31.37 2.91,31.37 JP1.8
  Bottom 0.203: U2.11 4.34,32.62 JP1.8
SERIAL_CLK_2
  Top 0.203: U4.11 44.93,13.08 46.23,11.79 47.75,11.79 48.77,12.8 48.77,16.95 JP2.8
  Bottom 0.203: U3.11 45.17,16.89 JP2.8
SERIAL_IN  (via drill 0.7)
  Top 0.203: U1.14 8.34,32.62 8.64,32.92 8.64,35.56 9.55,36.47 9.55,37.9 8.64,38.81 8.64,41.35 v6.4,43.59
  Bottom 0.203: v6.4,43.59 6.4,46.53 8.74,48.87 40.95,48.87 44.81,45.01 44.81,31.07 JP2.4
SERIAL_LATCH
  Top 0.203: U1.12 4.34,35.16 JP1.9
  Bottom 0.203: U2.12 3.07,33.89 JP1.9
SERIAL_LATCH_2
  Top 0.203: U4.12 45.17,14.35 JP2.9
  Bottom 0.203: U3.12 46.44,15.62 JP2.9
SERIAL_MR_L  (via drill 0.7)
  Top 0.203: v8.64,37.08 8.03,37.69 U1.10
  Bottom 0.203: JP1.7 5.61,31.35 U2.10 8.09,31.35 8.64,31.9 v8.64,37.08
SERIAL_MR_L_2  (via drill 0.7)
  Top 0.203: U4.10 41.63,11.81 41.35,12.09 41.35,16.66 v41.15,16.87
  Bottom 0.203: JP2.7 45.11,19.37 45.11,18.8 44.48,18.16 U3.10 43,18.09 41.76,18.09 41.15,17.48 v41.15,16.87
SERIAL_OE_L
  Top 0.203: U1.13 4.93,33.89 3.61,32.54 2.01,32.54 1.65,32.89 1.65,35.01 JP1.10
  Bottom 0.203: U2.13 4.2,35.16 JP1.10
SERIAL_OE_L_2
  Top 0.203: U4.13 44.48,15.62 46.33,17.48 47.65,17.48 48.26,16.87 48.36,16.76 48.36,15 JP2.10
  Bottom 0.203: U3.13 46.29,14.35 JP2.10
SERIAL_PASS  (via drill 0.7)
  Top 0.203: U1.9 4.53,38.97 v4.47,38.91
  Bottom 0.203: v4.47,38.91 4.47,37.19 5.18,36.47 6.78,36.47 U2.14
SERIAL_PASS1
  Bottom 0.203: U3.14 41.83,13.08 38.2,9.45 38.1,9.45 34.44,5.79 33.12,5.79 31.9,4.57 31.9,3.45 32.72,2.64 32.72,1.22 32.61,1.12 17.78,1.12 9.86,1.12 1.32,9.55 1.32,24.18 2.06,24.92 3.89,24.92 4.78,25.81 4.78,29.46 5.38,30.07 U2.9
SERIAL_PASS2  (via drill 0.7)
  Top 0.203: U4.14 44.42,16.89 44.91,17.37 44.91,20.32 v44.4,20.83
  Bottom 0.203: v44.4,20.83 43.69,20.83 43.08,20.22 U3.9

### Text on the board
Top: Rev 1.1 | Collin | Boots
Bottom: RMod | DigiRes | Rev 1.1
bNames: Collin Boots
tDocu: DigiRes-RMod | Collin Boots | Rev 1.1
bDocu: DigiRes-RMod | Rev 1.1